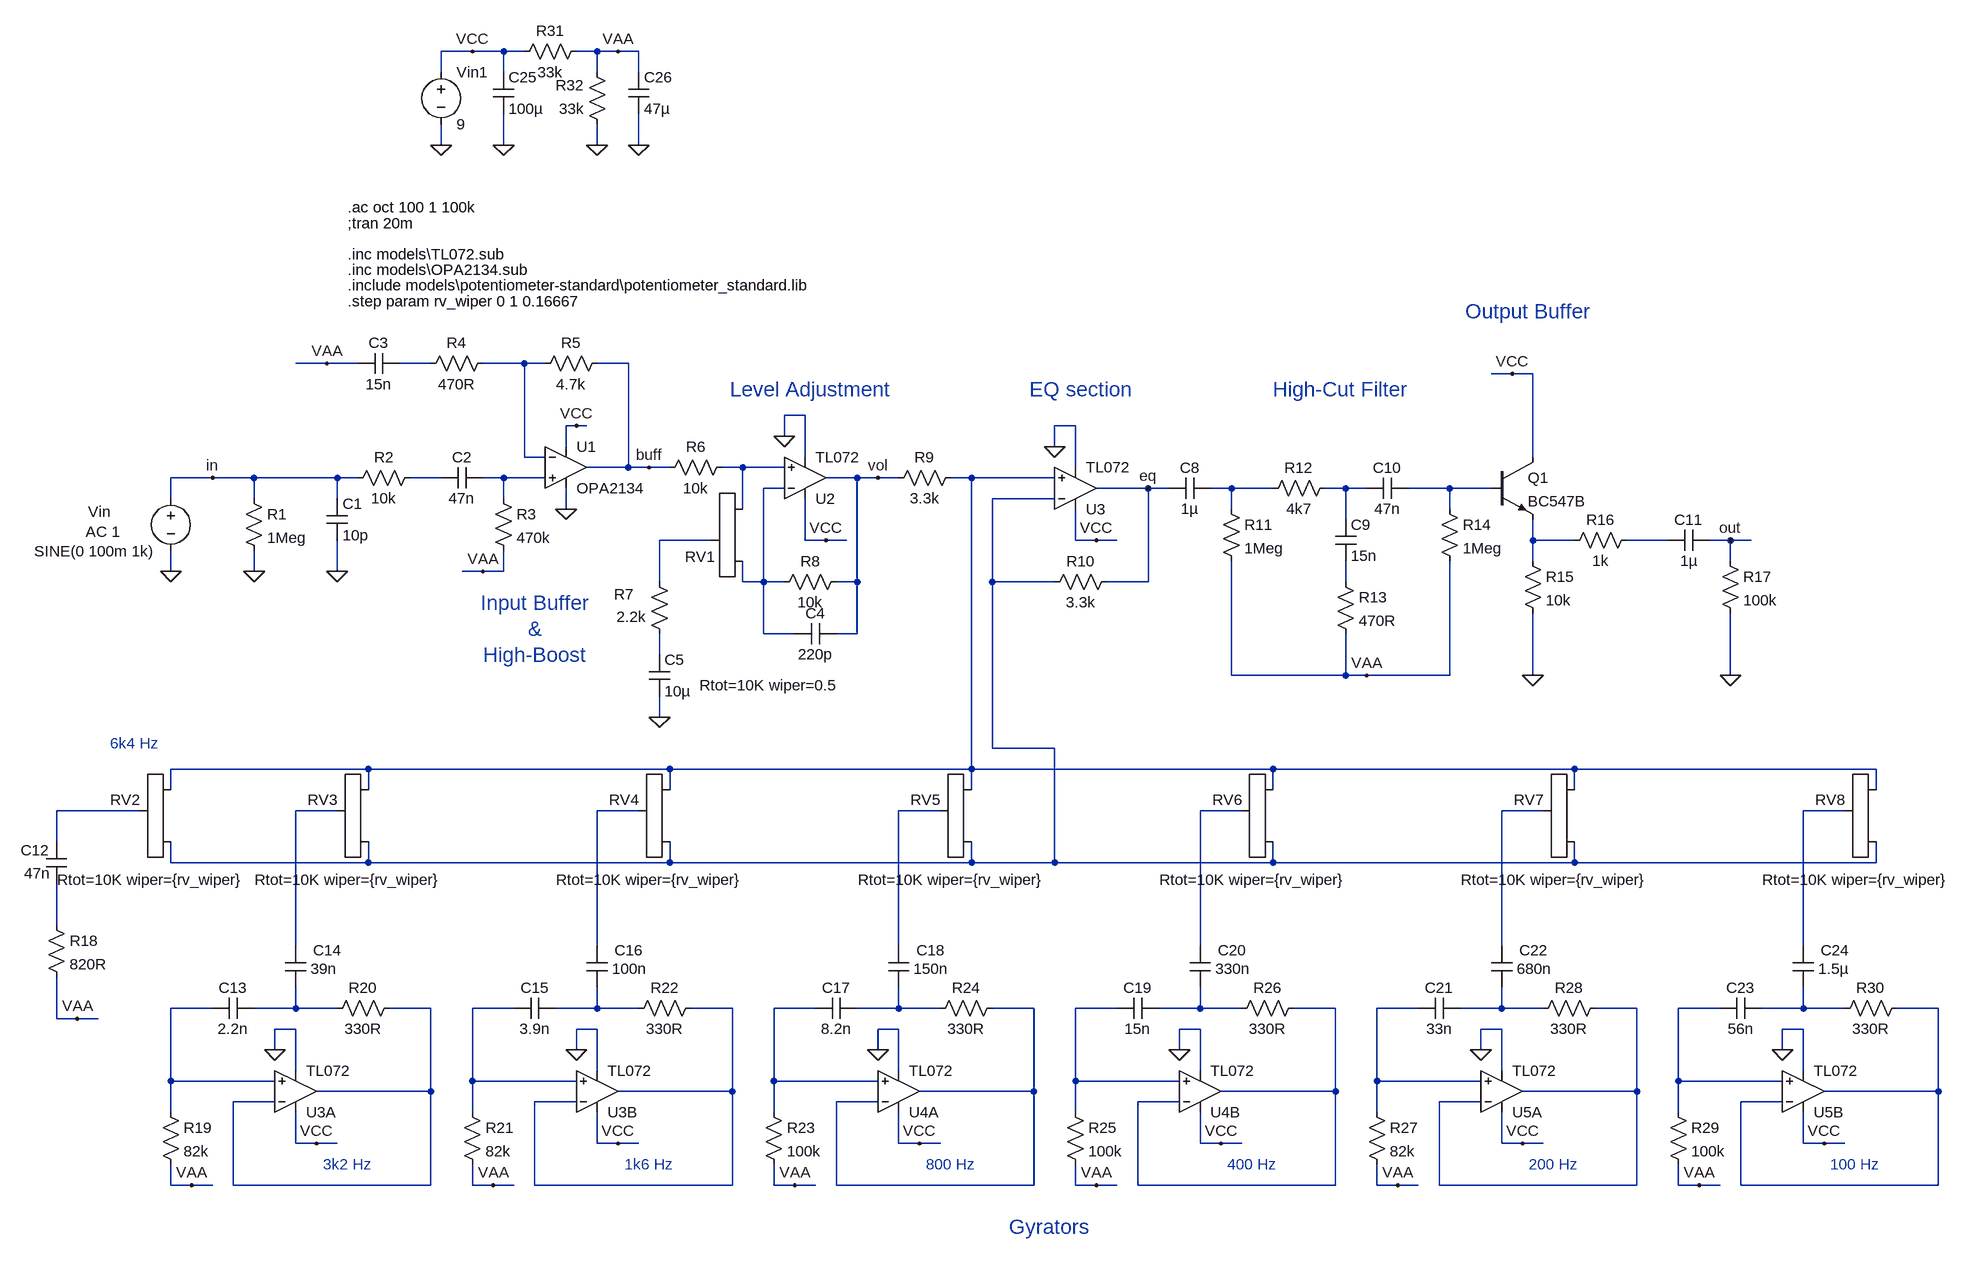
[diagram p0: schematic GE-7_stock_circuit.asc]
GE-7_stock_circuit.asc, the LTspice schematic file:
Version 4
SHEET 1 2276 680
WIRE 0 -1488 -48 -1488
WIRE 48 -1488 0 -1488
WIRE 80 -1488 48 -1488
WIRE 192 -1488 160 -1488
WIRE 224 -1488 192 -1488
WIRE 256 -1488 224 -1488
WIRE -48 -1456 -48 -1488
WIRE 48 -1456 48 -1488
WIRE 192 -1456 192 -1488
WIRE 256 -1456 256 -1488
WIRE -48 -1344 -48 -1376
WIRE 48 -1344 48 -1392
WIRE 192 -1344 192 -1376
WIRE 256 -1344 256 -1392
WIRE -224 -1008 -272 -1008
WIRE -176 -1008 -224 -1008
WIRE -64 -1008 -112 -1008
WIRE 80 -1008 16 -1008
WIRE 112 -1008 80 -1008
WIRE 240 -1008 192 -1008
WIRE 1600 -992 1568 -992
WIRE 1632 -992 1600 -992
WIRE 512 -928 480 -928
WIRE 160 -912 144 -912
WIRE 176 -912 160 -912
WIRE 928 -912 896 -912
WIRE 480 -896 480 -928
WIRE 144 -880 144 -912
WIRE 896 -880 896 -912
WIRE 80 -864 80 -1008
WIRE 112 -864 80 -864
WIRE 512 -864 512 -928
WIRE 1632 -864 1632 -992
WIRE 240 -848 240 -1008
WIRE 240 -848 176 -848
WIRE 272 -848 240 -848
WIRE 304 -848 272 -848
WIRE 416 -848 384 -848
WIRE 480 -848 416 -848
WIRE 928 -848 928 -912
WIRE -400 -832 -464 -832
WIRE -336 -832 -400 -832
WIRE -208 -832 -336 -832
WIRE -176 -832 -208 -832
WIRE -48 -832 -96 -832
WIRE 48 -832 16 -832
WIRE 112 -832 48 -832
WIRE 592 -832 544 -832
WIRE 624 -832 592 -832
WIRE 656 -832 624 -832
WIRE 768 -832 736 -832
WIRE 896 -832 768 -832
WIRE 480 -816 448 -816
WIRE 1040 -816 960 -816
WIRE 1072 -816 1040 -816
WIRE 1168 -816 1136 -816
WIRE 1232 -816 1168 -816
WIRE 1344 -816 1312 -816
WIRE 1376 -816 1344 -816
WIRE 1504 -816 1440 -816
WIRE 1568 -816 1504 -816
WIRE -464 -800 -464 -832
WIRE -336 -800 -336 -832
WIRE -208 -800 -208 -832
WIRE 48 -800 48 -832
WIRE 896 -800 800 -800
WIRE 144 -784 144 -816
WIRE 416 -784 416 -848
WIRE 1168 -784 1168 -816
WIRE 1504 -784 1504 -816
WIRE 1344 -768 1344 -816
WIRE 368 -736 288 -736
WIRE 512 -736 512 -800
WIRE 544 -736 512 -736
WIRE 576 -736 544 -736
WIRE 928 -736 928 -784
WIRE 960 -736 928 -736
WIRE 992 -736 960 -736
WIRE 1632 -736 1632 -768
WIRE 1696 -736 1632 -736
WIRE 1840 -736 1776 -736
WIRE 1936 -736 1904 -736
WIRE 1968 -736 1936 -736
WIRE 1632 -704 1632 -736
WIRE 1936 -704 1936 -736
WIRE -464 -688 -464 -720
WIRE -336 -688 -336 -720
WIRE -208 -688 -208 -736
WIRE 16 -688 -16 -688
WIRE 48 -688 48 -720
WIRE 48 -688 16 -688
WIRE 288 -672 288 -736
WIRE 416 -672 416 -704
WIRE 448 -672 448 -816
WIRE 448 -672 416 -672
WIRE 480 -672 448 -672
WIRE 592 -672 592 -832
WIRE 592 -672 560 -672
WIRE 800 -672 800 -800
WIRE 896 -672 800 -672
WIRE 1040 -672 1040 -816
WIRE 1040 -672 976 -672
WIRE 1344 -672 1344 -704
WIRE 448 -592 448 -672
WIRE 496 -592 448 -592
WIRE 592 -592 592 -672
WIRE 592 -592 560 -592
WIRE 288 -560 288 -592
WIRE 1168 -528 1168 -704
WIRE 1344 -528 1344 -592
WIRE 1344 -528 1168 -528
WIRE 1376 -528 1344 -528
WIRE 1504 -528 1504 -704
WIRE 1504 -528 1376 -528
WIRE 1632 -528 1632 -624
WIRE 1936 -528 1936 -624
WIRE 288 -464 288 -496
WIRE 800 -416 800 -672
WIRE 896 -416 800 -416
WIRE -160 -384 -464 -384
WIRE 304 -384 -160 -384
WIRE 768 -384 768 -832
WIRE 768 -384 304 -384
WIRE 1232 -384 768 -384
WIRE 1696 -384 1232 -384
WIRE 2160 -384 1696 -384
WIRE -464 -352 -464 -384
WIRE -160 -352 -160 -384
WIRE 304 -352 304 -384
WIRE 768 -352 768 -384
WIRE 1232 -352 1232 -384
WIRE 1696 -352 1696 -384
WIRE 2160 -352 2160 -384
WIRE -512 -320 -640 -320
WIRE -208 -320 -272 -320
WIRE 256 -320 192 -320
WIRE 720 -320 656 -320
WIRE 1184 -320 1120 -320
WIRE 1648 -320 1584 -320
WIRE 2112 -320 2048 -320
WIRE -640 -272 -640 -320
WIRE -464 -240 -464 -272
WIRE -160 -240 -160 -272
WIRE -160 -240 -464 -240
WIRE 304 -240 304 -272
WIRE 304 -240 -160 -240
WIRE 768 -240 768 -272
WIRE 768 -240 304 -240
WIRE 896 -240 896 -416
WIRE 896 -240 768 -240
WIRE 1232 -240 1232 -272
WIRE 1232 -240 896 -240
WIRE 1696 -240 1696 -272
WIRE 1696 -240 1232 -240
WIRE 2160 -240 2160 -272
WIRE 2160 -240 1696 -240
WIRE -640 -144 -640 -208
WIRE -272 -112 -272 -320
WIRE 192 -112 192 -320
WIRE 656 -112 656 -320
WIRE 1120 -112 1120 -320
WIRE 1584 -112 1584 -320
WIRE 2048 -112 2048 -320
WIRE -400 -16 -464 -16
WIRE -272 -16 -272 -48
WIRE -272 -16 -336 -16
WIRE -208 -16 -272 -16
WIRE -64 -16 -128 -16
WIRE 64 -16 0 -16
WIRE 192 -16 192 -48
WIRE 192 -16 128 -16
WIRE 256 -16 192 -16
WIRE 400 -16 336 -16
WIRE 528 -16 464 -16
WIRE 656 -16 656 -48
WIRE 656 -16 592 -16
WIRE 720 -16 656 -16
WIRE 864 -16 800 -16
WIRE 992 -16 928 -16
WIRE 1120 -16 1120 -48
WIRE 1120 -16 1056 -16
WIRE 1184 -16 1120 -16
WIRE 1328 -16 1264 -16
WIRE 1456 -16 1392 -16
WIRE 1584 -16 1584 -48
WIRE 1584 -16 1520 -16
WIRE 1648 -16 1584 -16
WIRE 1792 -16 1728 -16
WIRE 1920 -16 1856 -16
WIRE 2048 -16 2048 -48
WIRE 2048 -16 1984 -16
WIRE 2112 -16 2048 -16
WIRE 2256 -16 2192 -16
WIRE -640 0 -640 -64
WIRE -608 0 -640 0
WIRE -576 0 -608 0
WIRE -272 16 -304 16
WIRE 192 16 160 16
WIRE 656 16 624 16
WIRE 1120 16 1088 16
WIRE 1584 16 1552 16
WIRE 2048 16 2016 16
WIRE -304 48 -304 16
WIRE 160 48 160 16
WIRE 624 48 624 16
WIRE 1088 48 1088 16
WIRE 1552 48 1552 16
WIRE 2016 48 2016 16
WIRE -272 80 -272 16
WIRE 192 80 192 16
WIRE 656 80 656 16
WIRE 1120 80 1120 16
WIRE 1584 80 1584 16
WIRE 2048 80 2048 16
WIRE -464 96 -464 -16
WIRE -304 96 -464 96
WIRE 0 96 0 -16
WIRE 160 96 0 96
WIRE 464 96 464 -16
WIRE 624 96 464 96
WIRE 928 96 928 -16
WIRE 1088 96 928 96
WIRE 1392 96 1392 -16
WIRE 1552 96 1392 96
WIRE 1856 96 1856 -16
WIRE 2016 96 1856 96
WIRE -64 112 -64 -16
WIRE -64 112 -240 112
WIRE 400 112 400 -16
WIRE 400 112 224 112
WIRE 864 112 864 -16
WIRE 864 112 688 112
WIRE 1328 112 1328 -16
WIRE 1328 112 1152 112
WIRE 1792 112 1792 -16
WIRE 1792 112 1616 112
WIRE 2256 112 2256 -16
WIRE 2256 112 2080 112
WIRE -304 128 -368 128
WIRE 160 128 96 128
WIRE 624 128 560 128
WIRE 1088 128 1024 128
WIRE 1552 128 1488 128
WIRE 2016 128 1952 128
WIRE -464 144 -464 96
WIRE 0 144 0 96
WIRE 464 144 464 96
WIRE 928 144 928 96
WIRE 1392 144 1392 96
WIRE 1856 144 1856 96
WIRE -272 192 -272 144
WIRE -240 192 -272 192
WIRE -208 192 -240 192
WIRE 192 192 192 144
WIRE 224 192 192 192
WIRE 256 192 224 192
WIRE 656 192 656 144
WIRE 688 192 656 192
WIRE 720 192 688 192
WIRE 1120 192 1120 144
WIRE 1152 192 1120 192
WIRE 1184 192 1152 192
WIRE 1584 192 1584 144
WIRE 1616 192 1584 192
WIRE 1648 192 1616 192
WIRE 2048 192 2048 144
WIRE 2080 192 2048 192
WIRE 2112 192 2080 192
WIRE -464 256 -464 224
WIRE -432 256 -464 256
WIRE -400 256 -432 256
WIRE -368 256 -368 128
WIRE -64 256 -64 112
WIRE -64 256 -368 256
WIRE 0 256 0 224
WIRE 32 256 0 256
WIRE 64 256 32 256
WIRE 96 256 96 128
WIRE 400 256 400 112
WIRE 400 256 96 256
WIRE 464 256 464 224
WIRE 496 256 464 256
WIRE 528 256 496 256
WIRE 560 256 560 128
WIRE 864 256 864 112
WIRE 864 256 560 256
WIRE 928 256 928 224
WIRE 960 256 928 256
WIRE 992 256 960 256
WIRE 1024 256 1024 128
WIRE 1328 256 1328 112
WIRE 1328 256 1024 256
WIRE 1392 256 1392 224
WIRE 1424 256 1392 256
WIRE 1456 256 1424 256
WIRE 1488 256 1488 128
WIRE 1792 256 1792 112
WIRE 1792 256 1488 256
WIRE 1856 256 1856 224
WIRE 1888 256 1856 256
WIRE 1920 256 1888 256
WIRE 1952 256 1952 128
WIRE 2256 256 2256 112
WIRE 2256 256 1952 256
FLAG -336 -688 0
FLAG -208 -688 0
FLAG -464 -688 0
FLAG -400 -832 in
FLAG -48 -1344 0
FLAG 48 -1344 0
FLAG 192 -1344 0
FLAG 224 -1488 VAA
FLAG 0 -1488 VCC
FLAG 256 -1344 0
FLAG 160 -912 VCC
FLAG 144 -784 0
FLAG 16 -688 VAA
FLAG 288 -464 0
FLAG 544 -736 VCC
FLAG 480 -896 0
FLAG 624 -832 vol
FLAG -224 -1008 VAA
FLAG 896 -880 0
FLAG 960 -736 VCC
FLAG 624 48 0
FLAG 688 192 VCC
FLAG 496 256 VAA
FLAG 272 -848 buff
FLAG 1936 -736 out
FLAG 160 48 0
FLAG 224 192 VCC
FLAG 32 256 VAA
FLAG -304 48 0
FLAG -240 192 VCC
FLAG -432 256 VAA
FLAG -608 0 VAA
FLAG 1088 48 0
FLAG 1152 192 VCC
FLAG 960 256 VAA
FLAG 1552 48 0
FLAG 1616 192 VCC
FLAG 1424 256 VAA
FLAG 2016 48 0
FLAG 2080 192 VCC
FLAG 1888 256 VAA
FLAG 1376 -528 VAA
FLAG 1600 -992 VCC
FLAG 1632 -528 0
FLAG 1936 -528 0
FLAG 1040 -816 eq
SYMBOL res -352 -816 R0
SYMATTR InstName R1
SYMATTR Value 1Meg
SYMBOL cap -224 -800 R0
SYMATTR InstName C1
SYMATTR Value 10p
SYMBOL voltage -464 -816 R0
WINDOW 0 -127 36 Left 2
WINDOW 3 -210 97 Left 2
WINDOW 123 -131 67 Left 2
WINDOW 39 0 0 Left 2
SYMATTR InstName Vin
SYMATTR Value SINE(0 100m 1k)
SYMATTR Value2 AC 1
SYMBOL res -80 -848 R90
WINDOW 0 0 56 VBottom 2
WINDOW 3 32 56 VTop 2
SYMATTR InstName R2
SYMATTR Value 10k
SYMBOL cap 16 -848 R90
WINDOW 0 0 32 VBottom 2
WINDOW 3 32 32 VTop 2
SYMATTR InstName C2
SYMATTR Value 47n
SYMBOL res 32 -816 R0
SYMATTR InstName R3
SYMATTR Value 470k
SYMBOL Opamps\\opamp2 144 -912 R0
SYMATTR InstName U1
SYMATTR Value OPA2134
SYMBOL voltage -48 -1472 R0
WINDOW 123 0 0 Left 2
WINDOW 39 0 0 Left 2
SYMATTR InstName Vin1
SYMATTR Value 9
SYMBOL cap 32 -1456 R0
SYMATTR InstName C25
SYMATTR Value 100µ
SYMBOL res 176 -1504 R90
WINDOW 0 0 56 VBottom 2
WINDOW 3 32 56 VTop 2
SYMATTR InstName R31
SYMATTR Value 33k
SYMBOL res 208 -1360 R180
WINDOW 0 36 76 Left 2
WINDOW 3 36 40 Left 2
SYMATTR InstName R32
SYMATTR Value 33k
SYMBOL cap 240 -1456 R0
SYMATTR InstName C26
SYMATTR Value 47µ
SYMBOL res 32 -1024 R90
WINDOW 0 0 56 VBottom 2
WINDOW 3 32 56 VTop 2
SYMATTR InstName R4
SYMATTR Value 470R
SYMBOL res 208 -1024 R90
WINDOW 0 0 56 VBottom 2
WINDOW 3 32 56 VTop 2
SYMATTR InstName R5
SYMATTR Value 4.7k
SYMBOL cap -112 -1024 R90
WINDOW 0 0 32 VBottom 2
WINDOW 3 32 32 VTop 2
SYMATTR InstName C3
SYMATTR Value 15n
SYMBOL res 400 -864 R90
WINDOW 0 0 56 VBottom 2
WINDOW 3 32 56 VTop 2
SYMATTR InstName R6
SYMATTR Value 10k
SYMBOL res 272 -688 R0
WINDOW 0 -54 35 Left 2
WINDOW 3 -50 70 Left 2
SYMATTR InstName R7
SYMATTR Value 2.2k
SYMBOL cap 272 -560 R0
SYMATTR InstName C5
SYMATTR Value 10µ
SYMBOL Opamps\\opamp2 512 -768 M180
SYMATTR InstName U2
SYMATTR Value TL072
SYMBOL res 576 -688 R90
WINDOW 0 0 56 VBottom 2
WINDOW 3 32 56 VTop 2
SYMATTR InstName R8
SYMATTR Value 10k
SYMBOL cap 560 -608 R90
WINDOW 0 0 32 VBottom 2
WINDOW 3 32 32 VTop 2
SYMATTR InstName C4
SYMATTR Value 220p
SYMBOL res 752 -848 R90
WINDOW 0 0 56 VBottom 2
WINDOW 3 32 56 VTop 2
SYMATTR InstName R9
SYMATTR Value 3.3k
SYMBOL Opamps\\opamp2 928 -752 M180
SYMATTR InstName U3
SYMATTR Value TL072
SYMBOL res 992 -688 R90
WINDOW 0 0 56 VBottom 2
WINDOW 3 32 56 VTop 2
SYMATTR InstName R10
SYMATTR Value 3.3k
SYMBOL cap 1136 -832 R90
WINDOW 0 0 32 VBottom 2
WINDOW 3 32 32 VTop 2
SYMATTR InstName C8
SYMATTR Value 1µ
SYMBOL cap 640 -112 R0
WINDOW 0 43 7 Left 2
WINDOW 3 39 35 Left 2
SYMATTR InstName C18
SYMATTR Value 150n
SYMBOL res 1152 -800 R0
SYMATTR InstName R11
SYMATTR Value 1Meg
SYMBOL res 816 -32 R90
WINDOW 0 0 56 VBottom 2
WINDOW 3 32 56 VTop 2
SYMATTR InstName R24
SYMATTR Value 330R
SYMBOL cap 592 -32 R90
WINDOW 0 0 32 VBottom 2
WINDOW 3 32 32 VTop 2
SYMATTR InstName C17
SYMATTR Value 8.2n
SYMBOL Opamps\\opamp2 656 176 M180
SYMATTR InstName U4A
SYMATTR Value TL072
SYMBOL res 448 128 R0
SYMATTR InstName R23
SYMATTR Value 100k
SYMBOL cap -656 -272 R0
WINDOW 0 -39 13 Left 2
WINDOW 3 -34 48 Left 2
SYMATTR InstName C12
SYMATTR Value 47n
SYMBOL res -656 -160 R0
SYMATTR InstName R18
SYMATTR Value 820R
SYMBOL potentiometer_standard 432 -800 M0
WINDOW 0 58 89 Left 2
WINDOW 3 -131 287 Left 2
WINDOW 39 -106 314 Left 2
WINDOW 38 38 112 Left 2
SYMATTR InstName RV1
SYMATTR Value Rtot=10K wiper=0.5
SYMBOL cap 176 -112 R0
WINDOW 0 43 7 Left 2
WINDOW 3 39 35 Left 2
SYMATTR InstName C16
SYMATTR Value 100n
SYMBOL res 352 -32 R90
WINDOW 0 0 56 VBottom 2
WINDOW 3 32 56 VTop 2
SYMATTR InstName R22
SYMATTR Value 330R
SYMBOL cap 128 -32 R90
WINDOW 0 0 32 VBottom 2
WINDOW 3 32 32 VTop 2
SYMATTR InstName C15
SYMATTR Value 3.9n
SYMBOL Opamps\\opamp2 192 176 M180
SYMATTR InstName U3B
SYMATTR Value TL072
SYMBOL res -16 128 R0
SYMATTR InstName R21
SYMATTR Value 82k
SYMBOL cap -288 -112 R0
WINDOW 0 43 7 Left 2
WINDOW 3 39 35 Left 2
SYMATTR InstName C14
SYMATTR Value 39n
SYMBOL res -112 -32 R90
WINDOW 0 0 56 VBottom 2
WINDOW 3 32 56 VTop 2
SYMATTR InstName R20
SYMATTR Value 330R
SYMBOL cap -336 -32 R90
WINDOW 0 0 32 VBottom 2
WINDOW 3 32 32 VTop 2
SYMATTR InstName C13
SYMATTR Value 2.2n
SYMBOL Opamps\\opamp2 -272 176 M180
SYMATTR InstName U3A
SYMATTR Value TL072
SYMBOL res -480 128 R0
SYMATTR InstName R19
SYMATTR Value 82k
SYMBOL potentiometer_standard -144 -256 R180
WINDOW 0 63 81 Left 2
WINDOW 3 -97 -42 Left 2
WINDOW 39 -88 -75 Left 2
WINDOW 38 42 43 Left 2
SYMATTR InstName RV3
SYMATTR Value Rtot=10K wiper={rv_wiper}
SYMBOL potentiometer_standard -448 -256 R180
WINDOW 0 63 81 Left 2
WINDOW 3 -97 -42 Left 2
WINDOW 39 -88 -75 Left 2
WINDOW 38 42 43 Left 2
SYMATTR InstName RV2
SYMATTR Value Rtot=10K wiper={rv_wiper}
SYMBOL potentiometer_standard 320 -256 R180
WINDOW 0 63 81 Left 2
WINDOW 3 -97 -42 Left 2
WINDOW 39 -88 -75 Left 2
WINDOW 38 42 43 Left 2
SYMATTR InstName RV4
SYMATTR Value Rtot=10K wiper={rv_wiper}
SYMBOL potentiometer_standard 784 -256 R180
WINDOW 0 63 81 Left 2
WINDOW 3 -97 -42 Left 2
WINDOW 39 -88 -75 Left 2
WINDOW 38 42 43 Left 2
SYMATTR InstName RV5
SYMATTR Value Rtot=10K wiper={rv_wiper}
SYMBOL cap 1104 -112 R0
WINDOW 0 43 7 Left 2
WINDOW 3 39 35 Left 2
SYMATTR InstName C20
SYMATTR Value 330n
SYMBOL res 1280 -32 R90
WINDOW 0 0 56 VBottom 2
WINDOW 3 32 56 VTop 2
SYMATTR InstName R26
SYMATTR Value 330R
SYMBOL cap 1056 -32 R90
WINDOW 0 0 32 VBottom 2
WINDOW 3 32 32 VTop 2
SYMATTR InstName C19
SYMATTR Value 15n
SYMBOL Opamps\\opamp2 1120 176 M180
SYMATTR InstName U4B
SYMATTR Value TL072
SYMBOL res 912 128 R0
SYMATTR InstName R25
SYMATTR Value 100k
SYMBOL potentiometer_standard 1248 -256 R180
WINDOW 0 63 81 Left 2
WINDOW 3 -97 -42 Left 2
WINDOW 39 -88 -75 Left 2
WINDOW 38 42 43 Left 2
SYMATTR InstName RV6
SYMATTR Value Rtot=10K wiper={rv_wiper}
SYMBOL cap 1568 -112 R0
WINDOW 0 43 7 Left 2
WINDOW 3 39 35 Left 2
SYMATTR InstName C22
SYMATTR Value 680n
SYMBOL res 1744 -32 R90
WINDOW 0 0 56 VBottom 2
WINDOW 3 32 56 VTop 2
SYMATTR InstName R28
SYMATTR Value 330R
SYMBOL cap 1520 -32 R90
WINDOW 0 0 32 VBottom 2
WINDOW 3 32 32 VTop 2
SYMATTR InstName C21
SYMATTR Value 33n
SYMBOL Opamps\\opamp2 1584 176 M180
SYMATTR InstName U5A
SYMATTR Value TL072
SYMBOL res 1376 128 R0
SYMATTR InstName R27
SYMATTR Value 82k
SYMBOL potentiometer_standard 1712 -256 R180
WINDOW 0 63 81 Left 2
WINDOW 3 -97 -42 Left 2
WINDOW 39 -88 -75 Left 2
WINDOW 38 42 43 Left 2
SYMATTR InstName RV7
SYMATTR Value Rtot=10K wiper={rv_wiper}
SYMBOL cap 2032 -112 R0
WINDOW 0 43 7 Left 2
WINDOW 3 39 35 Left 2
SYMATTR InstName C24
SYMATTR Value 1.5µ
SYMBOL res 2208 -32 R90
WINDOW 0 0 56 VBottom 2
WINDOW 3 32 56 VTop 2
SYMATTR InstName R30
SYMATTR Value 330R
SYMBOL cap 1984 -32 R90
WINDOW 0 0 32 VBottom 2
WINDOW 3 32 32 VTop 2
SYMATTR InstName C23
SYMATTR Value 56n
SYMBOL Opamps\\opamp2 2048 176 M180
SYMATTR InstName U5B
SYMATTR Value TL072
SYMBOL res 1840 128 R0
SYMATTR InstName R29
SYMATTR Value 100k
SYMBOL potentiometer_standard 2176 -256 R180
WINDOW 0 63 81 Left 2
WINDOW 3 -97 -42 Left 2
WINDOW 39 -88 -75 Left 2
WINDOW 38 42 43 Left 2
SYMATTR InstName RV8
SYMATTR Value Rtot=10K wiper={rv_wiper}
SYMBOL res 1328 -832 R90
WINDOW 0 0 56 VBottom 2
WINDOW 3 32 56 VTop 2
SYMATTR InstName R12
SYMATTR Value 4k7
SYMBOL cap 1328 -768 R0
SYMATTR InstName C9
SYMATTR Value 15n
SYMBOL res 1328 -688 R0
SYMATTR InstName R13
SYMATTR Value 470R
SYMBOL cap 1440 -832 R90
WINDOW 0 0 32 VBottom 2
WINDOW 3 32 32 VTop 2
SYMATTR InstName C10
SYMATTR Value 47n
SYMBOL res 1488 -800 R0
SYMATTR InstName R14
SYMATTR Value 1Meg
SYMBOL npn 1568 -864 R0
SYMATTR InstName Q1
SYMATTR Value BC547B
SYMBOL res 1616 -720 R0
SYMATTR InstName R15
SYMATTR Value 10k
SYMBOL res 1792 -752 R90
WINDOW 0 0 56 VBottom 2
WINDOW 3 32 56 VTop 2
SYMATTR InstName R16
SYMATTR Value 1k
SYMBOL cap 1904 -752 R90
WINDOW 0 0 32 VBottom 2
WINDOW 3 32 32 VTop 2
SYMATTR InstName C11
SYMATTR Value 1µ
SYMBOL res 1920 -720 R0
SYMATTR InstName R17
SYMATTR Value 100k
TEXT -192 -1224 Left 2 !;tran 20m
TEXT -192 -1176 Left 2 !.inc models\\TL072.sub
TEXT -192 -1248 Left 2 !.ac oct 100 1 100k
TEXT -192 -1152 Left 2 !.inc models\\OPA2134.sub
TEXT -192 -1128 Left 2 !.include models\\potentiometer-standard\\potentiometer_standard.lib
TEXT 736 224 Center 2 ;800 Hz
TEXT 272 224 Center 2 ;1k6 Hz
TEXT -192 224 Center 2 ;3k2 Hz
TEXT -520 -424 Center 2 ;6k4 Hz
TEXT 1200 224 Center 2 ;400 Hz
TEXT 1664 224 Center 2 ;200 Hz
TEXT 2128 224 Center 2 ;100 Hz
TEXT -192 -1104 Left 2 !.step param rv_wiper 0 1 0.16667
TEXT 96 -640 Center 3 ;Input Buffer
TEXT 520 -968 Center 3 ;Level Adjustment
TEXT 936 -968 Center 3 ;EQ section
TEXT 888 320 Center 3 ;Gyrators
TEXT 1336 -968 Center 3 ;High-Cut Filter
TEXT 1624 -1088 Center 3 ;Output Buffer
TEXT 96 -600 Center 3 ;&
TEXT 96 -560 Center 3 ;High-Boost

The netlist it stands for:
* GE-7_stock_circuit.asc
R1 in 0 1Meg
C1 in 0 10p
Vin in 0 SINE(0 100m 1k) AC 1
R2 N004 in 10k
C2 N005 N004 47n
R3 N005 VAA 470k
XU1 N005 N002 VCC 0 buff OPA2134  ; pins In+ In- V+ V- OUT
Vin1 VCC 0 9
C25 VCC 0 100µ
R31 VAA VCC 33k
R32 0 VAA 33k
C26 VAA 0 47µ
R4 N002 N001 470R
R5 buff N002 4.7k
C3 N001 VAA 15n
R6 N003 buff 10k
R7 N012 N016 2.2k
C5 N016 0 10µ
XU2 N003 N007 VCC 0 vol TL072  ; pins In+ In- V+ V- OUT
R8 vol N007 10k
C4 vol N007 220p
R9 N006 vol 3.3k
XU3 N006 N011 VCC 0 eq TL072  ; pins In+ In- V+ V- OUT
R10 eq N011 3.3k
C8 N008 eq 1µ
C18 N020 N032 150n
R11 N008 VAA 1Meg
R24 N033 N032 330R
C17 N032 N031 8.2n
XU4A N031 N033 VCC 0 N033 TL072  ; pins In+ In- V+ V- OUT
R23 N031 VAA 100k
C12 N017 N024 47n
R18 N024 VAA 820R
XRV1 N003 N007 N012 Rtot=10K wiper=0.5
C16 N019 N029 100n
R22 N030 N029 330R
C15 N029 N028 3.9n
XU3B N028 N030 VCC 0 N030 TL072  ; pins In+ In- V+ V- OUT
R21 N028 VAA 82k
C14 N018 N026 39n
R20 N027 N026 330R
C13 N026 N025 2.2n
XU3A N025 N027 VCC 0 N027 TL072  ; pins In+ In- V+ V- OUT
R19 N025 VAA 82k
XRV3 N011 N006 N018 Rtot=10K wiper={rv_wiper}
XRV2 N011 N006 N017 Rtot=10K wiper={rv_wiper}
XRV4 N011 N006 N019 Rtot=10K wiper={rv_wiper}
XRV5 N011 N006 N020 Rtot=10K wiper={rv_wiper}
C20 N021 N035 330n
R26 N036 N035 330R
C19 N035 N034 15n
XU4B N034 N036 VCC 0 N036 TL072  ; pins In+ In- V+ V- OUT
R25 N034 VAA 100k
XRV6 N011 N006 N021 Rtot=10K wiper={rv_wiper}
C22 N022 N038 680n
R28 N039 N038 330R
C21 N038 N037 33n
XU5A N037 N039 VCC 0 N039 TL072  ; pins In+ In- V+ V- OUT
R27 N037 VAA 82k
XRV7 N011 N006 N022 Rtot=10K wiper={rv_wiper}
C24 N023 N041 1.5µ
R30 N042 N041 330R
C23 N041 N040 56n
XU5B N040 N042 VCC 0 N042 TL072  ; pins In+ In- V+ V- OUT
R29 N040 VAA 100k
XRV8 N011 N006 N023 Rtot=10K wiper={rv_wiper}
R12 N009 N008 4k7
C9 N009 N015 15n
R13 N015 VAA 470R
C10 N010 N009 47n
R14 N010 VAA 1Meg
Q1 VCC N010 N013 0 BC547B
R15 N013 0 10k
R16 N014 N013 1k
C11 out N014 1µ
R17 out 0 100k
.model NPN NPN
.model PNP PNP
.lib standard.bjt
;tran 20m
.inc models\TL072.sub
.ac oct 100 1 100k
.inc models\OPA2134.sub
.include models\potentiometer-standard\potentiometer_standard.lib
* 800 Hz
* 1k6 Hz
* 3k2 Hz
* 6k4 Hz
* 400 Hz
* 200 Hz
* 100 Hz
.step param rv_wiper 0 1 0.16667
* Input Buffer
* Level Adjustment
* EQ section
* Gyrators
* High-Cut Filter
* Output Buffer
* &
* High-Boost
.backanno
.end